# EAGLE design Sno_Shoe (EAGLE 9.6.2)
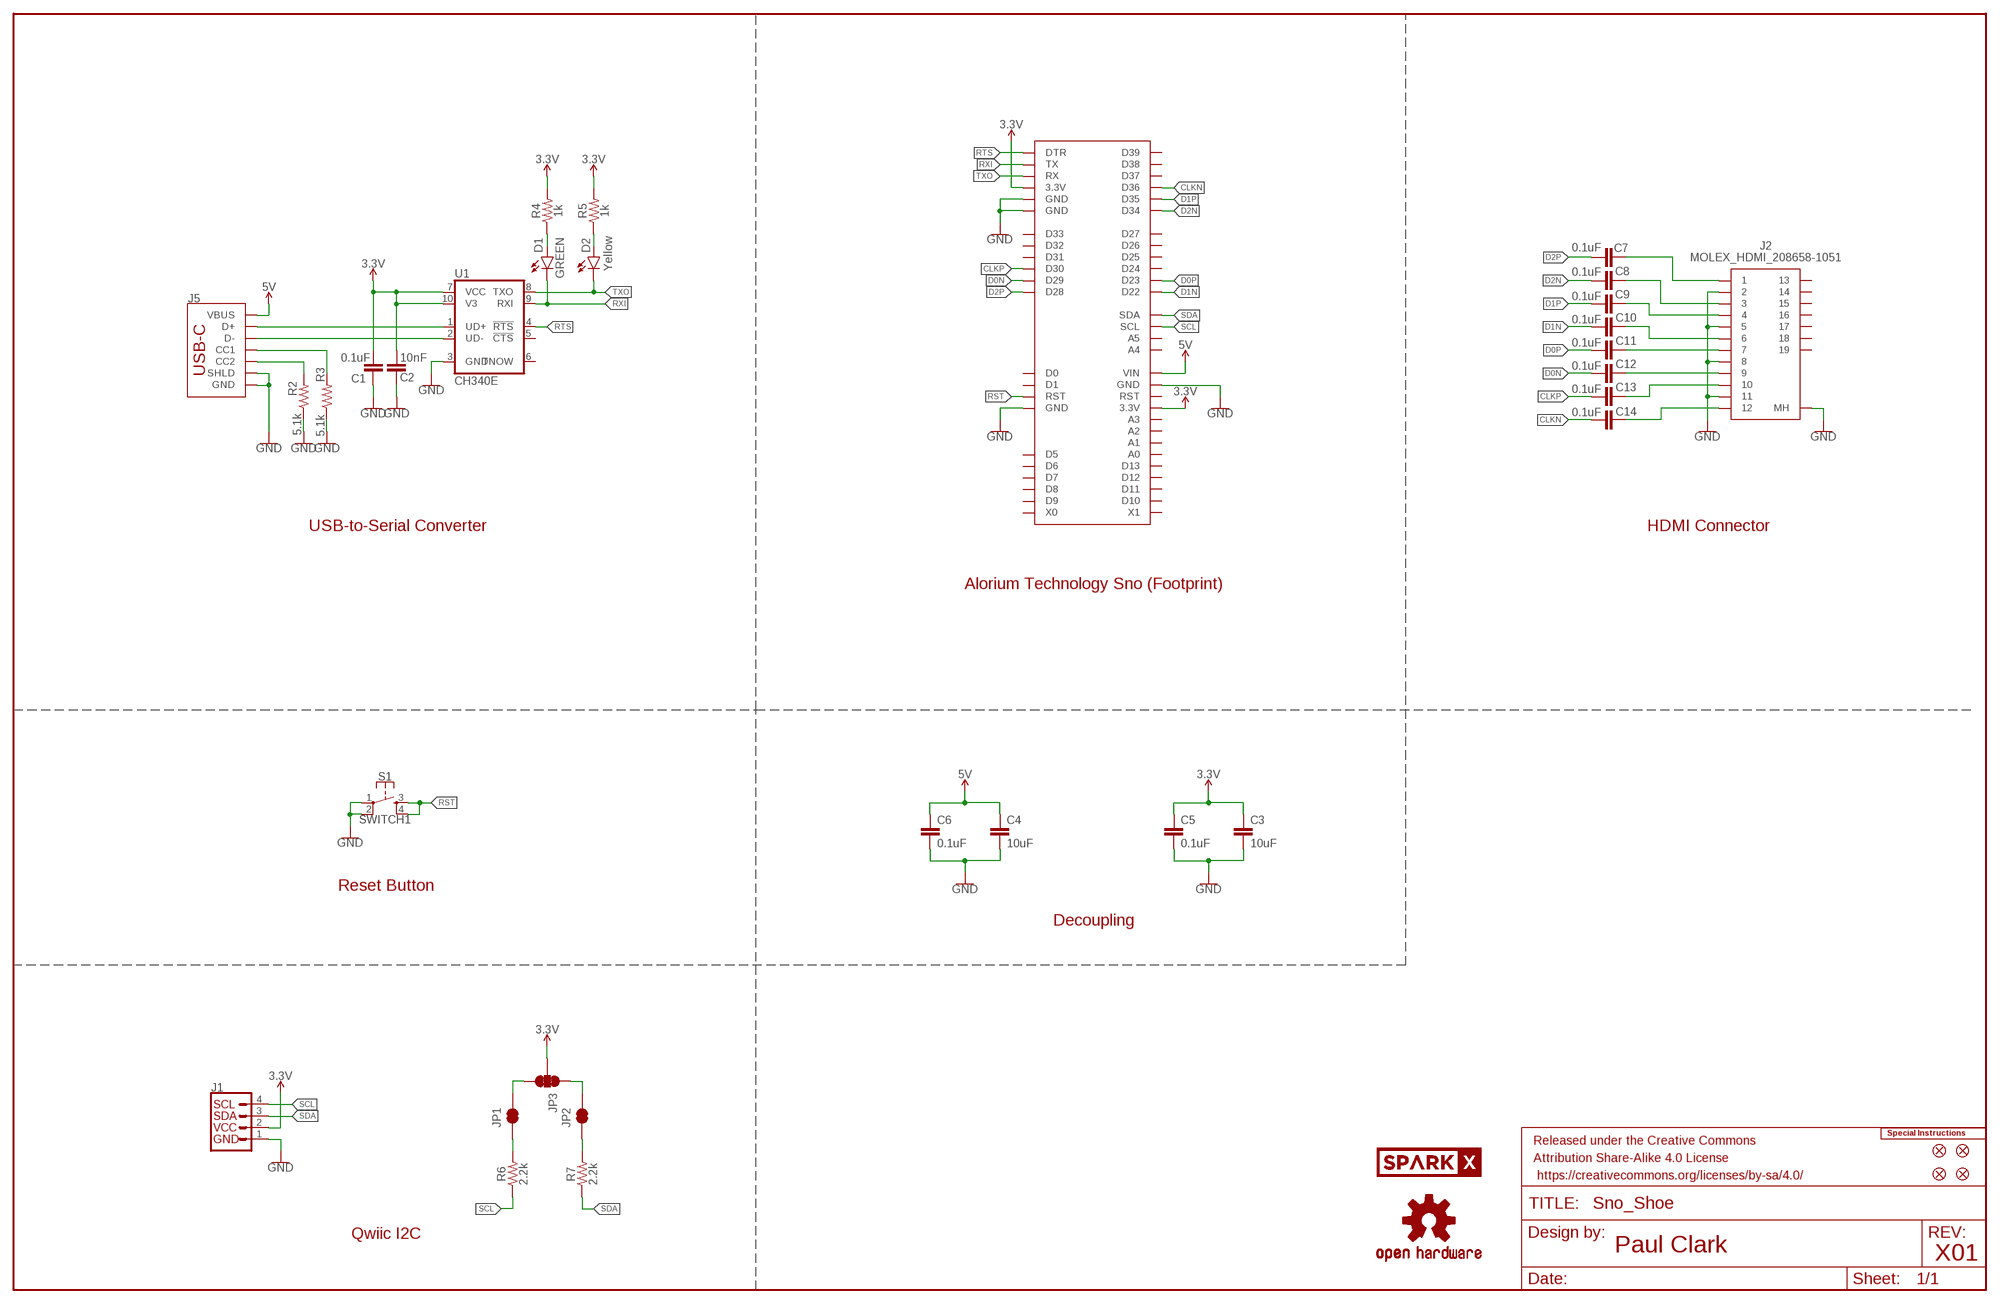
[diagram p0: schematic, sheet 1]

## Parts
C1  0.1uF  0.1UF-0402T-16V-10%  [0402-TIGHT]
C2  10nF  10NF-0402T-25V-10%  [0402-TIGHT]
C3  10uF  10UF-0402T-6.3V-20%  [0402-TIGHT]
C4  10uF  10UF-0805-10V-10%  [0805]
C5  0.1uF  0.1UF-0402T-10V-10%-X7R  [0402-TIGHT]
C6  0.1uF  0.1UF-0402T-10V-10%-X7R  [0402-TIGHT]
C7  0.1uF  0.1UF-0402T-10V-10%-X7R  [0402-TIGHT]
C8  0.1uF  0.1UF-0402T-10V-10%-X7R  [0402-TIGHT]
C9  0.1uF  0.1UF-0402T-10V-10%-X7R  [0402-TIGHT]
C10  0.1uF  0.1UF-0402T-10V-10%-X7R  [0402-TIGHT]
C11  0.1uF  0.1UF-0402T-10V-10%-X7R  [0402-TIGHT]
C12  0.1uF  0.1UF-0402T-10V-10%-X7R  [0402-TIGHT]
C13  0.1uF  0.1UF-0402T-10V-10%-X7R  [0402-TIGHT]
C14  0.1uF  0.1UF-0402T-10V-10%-X7R  [0402-TIGHT]
D1  GREEN  LED-GREEN0603  [LED-0603]
D2  Yellow  LED-YELLOW0603  [LED-0603]
FD1  FIDUCIAL1X2  [FIDUCIAL-1X2]
FD2  FIDUCIAL1X2  [FIDUCIAL-1X2]
FD3  FIDUCIAL1X2  [FIDUCIAL-1X2]
FD4  FIDUCIAL1X2  [FIDUCIAL-1X2]
FRAME1  FRAME-LEDGER  [CREATIVE_COMMONS]
J1  QWIIC_RIGHT_ANGLE  QWIIC_CONNECTORJS-1MM  [JST04_1MM_RA]
J2  MOLEX_HDMI_208658-1051  [MOLEX_HDMI_208658-1051]
J5  USB_C_4-LAYER_PADS  [USB-C-16P_4LAYER-PADS]
JP1  JUMPER-SMT_2_NC_TRACE_SILK  [SMT-JUMPER_2_NC_TRACE_SILK]
JP2  JUMPER-SMT_2_NC_TRACE_SILK  [SMT-JUMPER_2_NC_TRACE_SILK]
JP3  JUMPER-SMT_3_2-NC_TRACE_SILK  [SMT-JUMPER_3_2-NC_TRACE_SILK]
LOGO1  SPECIAL_INSTRUCTIONS-ORDERING  [ORDERING_INSTRUCTIONS]
LOGO2  OSHW-LOGOMINI  [OSHW-LOGO-MINI]
R2  5.1k  5.1KOHM-0402T-1/16W-1%  [0402-TIGHT]
R3  5.1k  5.1KOHM-0402T-1/16W-1%  [0402-TIGHT]
R4  1k  1KOHM-0402T-1/16W-1%  [0402-TIGHT]
R5  1k  1KOHM-0402T-1/16W-1%  [0402-TIGHT]
R6  2.2k  2.2KOHM-0402T-1/16W-1%  [0402-TIGHT]
R7  2.2k  2.2KOHM-0402T-1/16W-1%  [0402-TIGHT]
S1  SWITCH1  MOMENTARY-SWITCH-SPST-2-SMD-5.2MM-TALL  [TACTILE_SWITCH_SMD_5.2MM]
SPARKX2  SPARKX-LOGO4  [SPARKX-MEDIUM]
U1  CH340E  CH340E_MSOP10  [MSOP10]
U$1  SNO_MISSING_PINS  [SNO_MISSING_PINS]

## Nets
3.3V: C1.1 C2.1 C3.1 C5.1 J1.2 JP3.2 R4.2 R5.2 U1.7(VCC) U1.10(V3) U$1.P$28(3.3V) U$1.P$56(3.3V)
5V [Power]: C4.1 C6.1 J5.VBUS1(VBUS) J5.VBUS2(VBUS) U$1.P$31(VIN)
CC3: J5.B5(CC2) R2.2
CC4: J5.A5(CC1) R3.2
CLKN: C14.1 U$1.P$50(D36)
CLKP: C13.1 U$1.P$44(D30)
D0N: C12.1 U$1.P$43(D29)
D0P: C11.1 U$1.P$37(D23)
D1N: C10.1 U$1.P$36(D22)
D1P: C9.1 U$1.P$49(D35)
D2N: C8.1 U$1.P$48(D34)
D2P: C7.1 U$1.P$42(D28)
D+2: J5.A6(D+) J5.B6(D+) U1.1(UD+)
D-2: J5.A7(D-) J5.B7(D-) U1.2(UD-)
GND: C1.2 C2.2 C3.2 C4.2 C5.2 C6.2 J1.1 J2.2 J2.5 J2.8 J2.11 J2.MH1(MH) J2.MH2(MH) J2.MH3(MH) J2.MH4(MH) J5.GND J5.GND2(GND) J5.SHLD1(SHLD) J5.SHLD2(SHLD) J5.SHLD3(SHLD) J5.SHLD4(SHLD) R2.1 R3.1 S1.1 S1.2 U1.3(GND) U$1.P$4(GND) U$1.P$30(GND) U$1.P$54(GND) U$1.P$55(GND)
N$2: JP2.2 JP3.1
N$3: JP1.2 JP3.3
N$4: JP1.1 R6.2
N$5: JP2.1 R7.2
N$6: C7.2 J2.1
N$7: C8.2 J2.3
N$8: C9.2 J2.4
N$9: C10.2 J2.6
N$10: C11.2 J2.7
N$11: C12.2 J2.9
N$12: C13.2 J2.10
N$13: C14.2 J2.12
N$26: D1.A R4.1
N$27: D2.A R5.1
RST: S1.3 S1.4 U$1.P$3(RST)
RTS: U1.4(!RTS) U$1.P$59(DTR)
RXI: D1.C U1.9(RXI) U$1.P$58(TX)
SCL: J1.4 R6.1 U$1.P$34(SCL)
SDA: J1.3 R7.1 U$1.P$35(SDA)
TXO: D2.C U1.8(TXO) U$1.P$57(RX)
Unconnected: J2.13 J2.14 J2.15 J2.16 J2.17 J2.18 J2.19 U1.5(!CTS) U1.6(TNOW) U$1.P$1(D0) U$1.P$2(D1) U$1.P$8(D5) U$1.P$9(D6) U$1.P$10(D7) U$1.P$11(D8) U$1.P$12(D9) U$1.P$13(X0) U$1.P$19(X1) U$1.P$20(D10) U$1.P$21(D11) U$1.P$22(D12) U$1.P$23(D13) U$1.P$24(A0) U$1.P$25(A1) U$1.P$26(A2) U$1.P$27(A3) U$1.P$29(RST) U$1.P$32(A4) U$1.P$33(A5) U$1.P$38(D24) U$1.P$39(D25) U$1.P$40(D26) U$1.P$41(D27) U$1.P$45(D31) U$1.P$46(D32) U$1.P$47(D33) U$1.P$51(D37) U$1.P$52(D38) U$1.P$53(D39)

## Notes on the sheet
- USB-to-Serial Converter | HDMI Connector
- Alorium Technology Sno (Footprint)
- Reset Button
- Decoupling
- Qwiic I2C
- Paul Clark
- X01

## Library data of the parts
C1 = SparkFun-Capacitors:0.1UF: 0.1µF ceramic capacitors A capacitor is a passive two-terminal electrical component used to store electrical energy temporarily in an electric field.; PROD_ID: CAP-12416
C2 = SparkFun-Capacitors:10NF: 0.01uF/10nF/10,000pF ceramic capacitors A capacitor is a passive two-terminal electrical component used to store electrical energy temporarily in an electric field. CAP-09321; PROD_ID: CAP-14847
C3 = SparkFun-Capacitors:10UF: 10.0µF ceramic capacitors A capacitor is a passive two-terminal electrical component used to store electrical energy temporarily in an electric field.; PROD_ID: CAP-14848
C4 = SparkFun-Capacitors:10UF: 10.0µF ceramic capacitors A capacitor is a passive two-terminal electrical component used to store electrical energy temporarily in an electric field.; PROD_ID: CAP-11330
C5-C14 = SparkFun-Capacitors:0.1UF: 0.1µF ceramic capacitors A capacitor is a passive two-terminal electrical component used to store electrical energy temporarily in an electric field.; PROD_ID: CAP-15083
D1 = SparkFun-LED:LED-GREEN: Green SMD LED Used in manufacturing of various products at SparkFun Packages: 0603 - SMD 0603 package [Product Link] <http://www.futureelectronics.com/en/technologies/semiconductors/optoelectronics/leds/Pages/9894312-LTST-C190GKT.aspx?CrossPart=HSMG-C190&IM=0> LilyPad 1206 - SMD1206 LilyPad package [Product Link] <http://www.futureelectronics.com/en/Technologies/Product.aspx?ProductID=IN150NGHARVATEKCORPORATION2049943&IM=0> 1206 - SMD1206 package [Product Link] <http://www.futureelectronics.com/en/technologies/semiconductors/optoelectronics/leds/Pages/8315665-LTST-C150KGKT.aspx?IM=0> 1206 Bottom Mount -SMD 1206 Bottom Mount [Product Link] <http://www.digikey.com/product-detail/en/lite-on-inc/LTST-C230KGKT/160-1456-1-ND/386854> SparkFun Products: Pro Mini 328 -5V <https://www.sparkfun.com/products/821> RedBoard <https://www.sparkfun.com/products/12757> MP3 Trigger <https://www.sparkfun.com/products/13720> Makey Makey <https://www.sparkfun.com/products/11076>; PROD_ID: DIO-00821
D2 = SparkFun-LED:LED-YELLOW: Yellow SMD LED Used in manufacturing several products at SparkFun. Packages: 0603 - SMD 0603 package[Product Link] <http://www.kingbrightusa.com/product.asp?catalog_name=LED&product_id=APT1608SYCK> 0603 -SMART - SMART SMD 0603 package (more efficient/more expensive) [Product Link] <http://www.osram-os.com/osram_os/en/products/product-catalog/led-light-emitting-diodes/smartled-0603/ly-l29k/index.jsp> LilyPad - SMD1206 package[Product Datasheet] <https://www.sparkfun.com/datasheets/DevTools/LilyPad/Q150YUS4.pdf> SparkFun Products: Blynk Board <https://www.sparkfun.com/products/13794> IOIO-OTG <https://www.sparkfun.com/products/13613> XBee Explorer Serial <https://www.sparkfun.com/products/13225>; PROD_ID: DIO-09003
FD1-FD4 = SparkFun-Aesthetics:FIDUCIAL: Fiducial Alignment Points Point-of-reference for pick-and-place machines and other optical instruments.
FRAME1 = SparkFun-Aesthetics:FRAME-LEDGER: Schematic Frame - Ledger Standard 11x14 US Ledger frame
J1 = SparkFun-Connectors:QWIIC_CONNECTOR: SparkFun I2C Standard Qwiic Connector An SMD 1mm pitch JST connector makes it easy and quick (get it? Qwiic?) to connect I2C devices to each other. The Qwiic system <http://www.sparkfun.com/qwiic> enables fast and solderless connection between popular platforms and various sensors and actuators. We carry 200mm <https://www.sparkfun.com/products/14204>, 100mm <https://www.sparkfun.com/products/14205>, 50mm <https://www.sparkfun.com/products/14206>, and breadboard friendly <https://www.sparkfun.com/products/14207> Qwiic cables. We also offer 10 pcs strips <https://www.sparkfun.com/products/14323> the SMD connectors.; PROD_ID: CONN-13694
J2 = New_Parts:MOLEX_HDMI_208658-1051: 1.0 HDMI R/A HEADER ASSY (I/M TYPE) Source: Datasheet; DESCRIPTION: 1.0 HDMI R/A HEADER ASSY (I/M TYPE); MANUFACTURER_NAME: Molex; MANUFACTURER_PART_NUMBER: 208658-1051; MOUSER_PART_NUMBER: 538-208658-1051; MOUSER_PRICE-STOCK: https://www.mouser.co.uk/ProductDetail/Molex/208658-1051?qs=BJlw7L4Cy7%252Bu27sIkZU3Xw%3D%3D
J5 = SparkFun-Connectors:USB_C: USB Type C 16Pin Connector Super Speed pins not available on the 16-pin purely SMD connector so this part is best for USB 2.0 implementations. D1 and D2 are tied together enabling D+/- no matter which way the cable is plugged into the connector. The two channel configuration pins (CC1/2) are exposed. These are normally connected to ground via 5.1k resistors but can be reconfigured for high current/high power applications.; PROD_ID: CONN-14122
JP1 JP2 = SparkFun-Jumpers:JUMPER-SMT_2_NC_TRACE: Normally closed trace jumper This jumper has a trace between two pads so it's normally closed (NC). Use a razor knife to open the connection. For best results follow the IPC guidelines for cutting traces: Cutout at least 0.063 mm (0.005 in). Remove all loose material to clean up the cut area. Seal the cut with an approved epoxy. Reapply solder to reclose the connection.
JP3 = SparkFun-Jumpers:JUMPER-SMT_3_2-NC_TRACE: Normally closed trace jumper (2 of 2 connections) This jumper has a trace between all three pads so they are normally closed (NC). Use a razor knife to open the connection(s). For best results follow the IPC guidelines for cutting traces: Cutout at least 0.063 mm (0.005 in). Remove all loose material to clean up the cut area. Seal the cut with an approved epoxy. Reapply solder to reclose the connection(s).
LOGO1 = SparkFun-Aesthetics:SPECIAL_INSTRUCTIONS: Special Ordering/Production Instructions Alert Symbol for special PCB ordering instructions or unique production process warnings. Ordering Instructions Production Instructions Types of information that should be added to box: Copper weight Soldermask color Silk color PCB thickness Number of layers PCB Standard: 1.6mm FR4 1 oz copper immersion silver plating red soldermask white silkscreen Types of information that should be added to box: Special wash requirements Depaneling instructions Humidification Glue curing Default text settings: 0.07 inch 9% ratio 50% line distance
LOGO2 = SparkFun-Aesthetics:OSHW-LOGO: Open-Source Hardware (OSHW) Logo This logo indicates the piece of hardware it is found on incorporates a OSHW license and/or adheres to the definition of open source hardware found here: http://freedomdefined.org/OSHW
R2 R3 = SparkFun-Resistors:5.1KOHM; PROD_ID: RES-14340
R4 R5 = SparkFun-Resistors:1KOHM: 1kΩ resistor A resistor is a passive two-terminal electrical component that implements electrical resistance as a circuit element. Resistors act to reduce current flow, and, at the same time, act to lower voltage levels within circuits. - Wikipedia; PROD_ID: RES-14342
R6 R7 = SparkFun-Resistors:2.2KOHM: 2.2kΩ resistor A resistor is a passive two-terminal electrical component that implements electrical resistance as a circuit element. Resistors act to reduce current flow, and, at the same time, act to lower voltage levels within circuits. - Wikipedia; PROD_ID: RES-14341
S1 = SparkFun-Switches:MOMENTARY-SWITCH-SPST-2: Momentary Switch (Pushbutton) - SPST - Two Circuits Normally-open (NO) SPST momentary switches (buttons, pushbuttons). Schematic symbol includes two switch circuits. Variants SMD-4.6MMX2.8MM - 4.60mm x 2.80mm Tactile Momentary Button Switch - Used on SparkFun SAMD21 Mini Breakout <https://www.sparkfun.com/products/13664> SMD-5.2MM - Mini Pushbutton Switch - SMD <https://www.sparkfun.com/products/8720> - Used on Arduino Pro Mini <https://www.sparkfun.com/products/11114>; PROD_ID: SWCH-14139
SPARKX2 = SparkX:SPARKX-LOGO
U1 = SparkFun-IC-Comms:CH340E; PROD_ID: IC-14135
U$1 = New_Parts:SNO_MISSING_PINS: Alorium Technology - Snō Source: Mechanical Drawing <https://www.aloriumtech.com/documents/Sno_Mechanical_Drawing.pdf> Pin Map <https://www.aloriumtech.com/documents/Sno_Pin_Map.pdf> Schematic <https://www.aloriumtech.com/documents/Sno_Schematic.pdf>

## Net classes
1 Power: width 0.406 mm

## Board
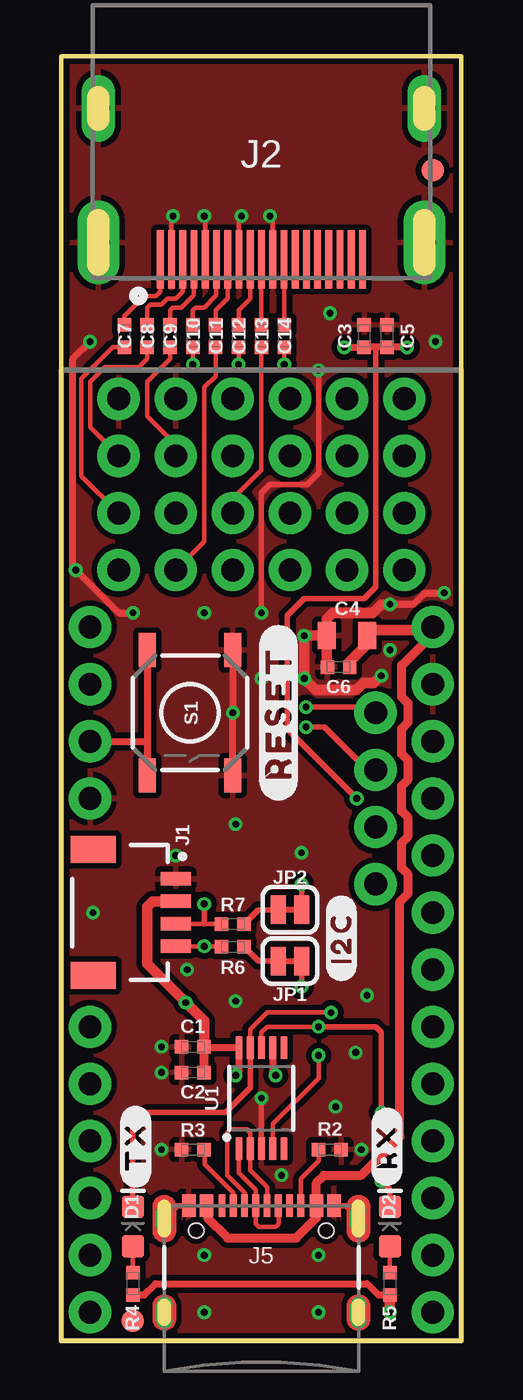
[diagram p1: board, top side]
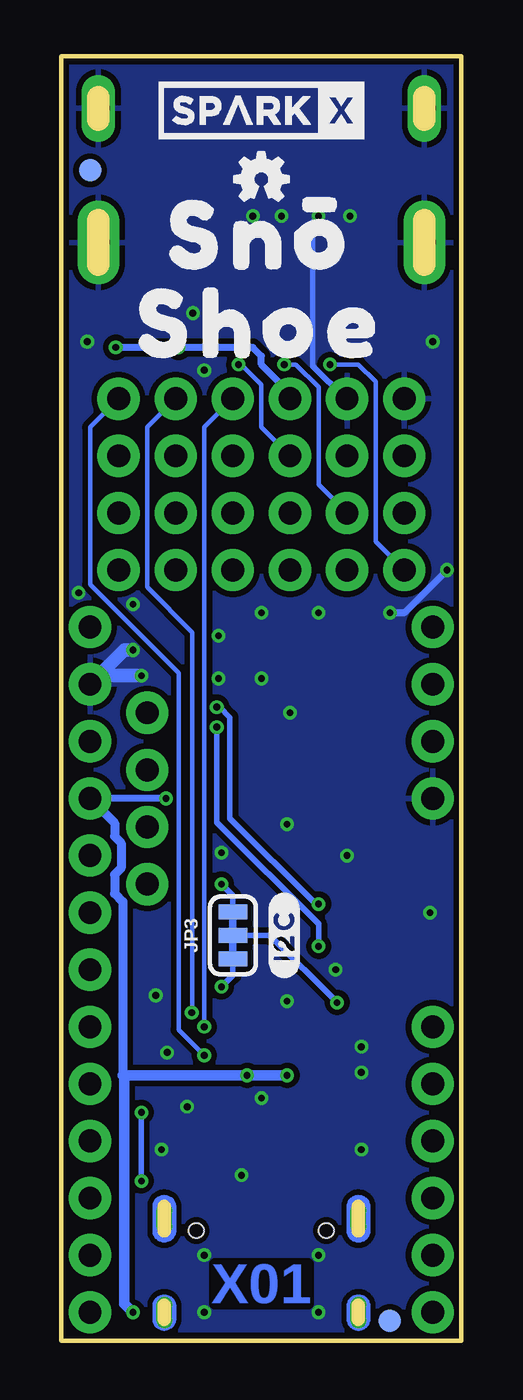
[diagram p2: board, bottom side, seen from below]

Size 17.78 x 57.15 mm. Coordinates in mm from the lower left corner, seen from the top.
Outline: 0,0 17.78,0 17.78,57.15 0,57.15 0,0
Copper layers (1*16): Top 0.035mm / dielectric 1.5mm / Bottom 0.035mm
Design rules "SparkFun-2-layer-PCBWay-LIMIT": minimum track width 6mil, minimum drill 0.3mm, track to track 6mil, track to pad 6mil, pad to pad 6mil, via to via 6mil, smd to smd 6mil, copper to edge 6mil, drill to drill 6mil, minimum pad ring 6mil, minimum via ring 6mil, stop-mask expansion 4mil, vias tented up to drill 25mil, thermal gap 10mil

### Footprints (pad centres in the part's own frame; a part is rotated, then mirrored left to right if it is on the bottom)
0402-TIGHT = smd 0.6 x 0.6: 1 -0.5,0; 2 0.5,0
0805 = smd 0.8 x 1.2: 1 -0.9,0; 2 0.9,0
LED-0603 = smd 1 x 1: A -0.877,0; C 0.877,0
FIDUCIAL-1X2 = smd 1 x 1: 1 0,0
JST04_1MM_RA = smd 0.6 x 1.35: 1 -1.5,0; 2 -0.5,0; 3 0.5,0; 4 1.5,0 | smd 1.2 x 2: NC1 2.8,-3.675; NC2 -2.8,-3.675
MOLEX_HDMI_208658-1051 = smd 0.3 x 2.6: 1 4.5,5.235; 2 4,5.235; 3 3.5,5.235; 4 3,5.235; 5 2.5,5.235; 6 2,5.235; 7 1.5,5.235; 8 1,5.235; 9 0.5,5.235; 10 0,5.235; 11 -0.5,5.235; 12 -1,5.235; 13 -1.5,5.235; 14 -2,5.235; 15 -2.5,5.235; 16 -3,5.235; 17 -3.5,5.235; 18 -4,5.235; 19 -4.5,5.235 | drill 1 pad 1.875 long: MH1 -7.25,4.475; MH2 7.25,4.475 | drill 1 long: MH3 -7.25,-1.485; MH4 7.25,-1.485
USB-C-16P_4LAYER-PADS = smd 0.3 x 1: A5 -1.25,-0.34; A6 -0.25,-0.34; A7 0.25,-0.34; A8 1.25,-0.34; B5 1.75,-0.34; B6 0.75,-0.34; B7 -0.75,-0.34; B8 -1.75,-0.34 | smd 0.6 x 1: GND -3.225,-0.34; GND2 3.225,-0.34; VBUS1 -2.45,-0.34; VBUS2 2.45,-0.34 | drill 0.4 pad 0.6 long: SHLD1 -4.318,-0.915; SHLD2 4.318,-0.915; SHLD3 -4.318,-5.095; SHLD4 4.318,-5.095 | hole 0.65: -2.89,-1.445; 2.89,-1.445
SMT-JUMPER_2_NC_TRACE_SILK = smd 0.66 x 1.27: 1 -0.521,0; 2 0.521,0
SMT-JUMPER_3_2-NC_TRACE_SILK = smd 0.66 x 1.27: 1 -1.041,0; 2 0,0; 3 1.041,0
TACTILE_SWITCH_SMD_5.2MM = smd 1.524 x 0.762: 1 -2.794,1.905; 2 2.794,1.905; 3 -2.794,-1.905; 4 2.794,-1.905
MSOP10 = smd 1 x 0.3: 1 -2.25,1; 2 -2.25,0.5; 3 -2.25,0; 4 -2.25,-0.5; 5 -2.25,-1; 6 2.25,-1; 7 2.25,-0.5; 8 2.25,0; 9 2.25,0.5; 10 2.25,1
SNO_MISSING_PINS = drill 1.016 pad 1.88: P$1 10.16,7.62; P$2 7.62,7.62; P$3 5.08,7.62; P$4 2.54,7.62; P$8 -7.62,7.62; P$9 -10.16,7.62; P$10 -12.7,7.62; P$11 -15.24,7.62; P$12 -17.78,7.62; P$13 -20.32,7.62; P$19 -20.32,-7.62; P$20 -17.78,-7.62; P$21 -15.24,-7.62; P$22 -12.7,-7.62; P$23 -10.16,-7.62; P$24 -7.62,-7.62; P$25 -5.08,-7.62; P$26 -2.54,-7.62; P$27 0,-7.62; P$28 2.54,-7.62; P$29 5.08,-7.62; P$30 7.62,-7.62; P$31 10.16,-7.62; P$32 -1.27,-5.08; P$33 1.27,-5.08; P$34 3.81,-5.08; P$35 6.35,-5.08; P$36 12.7,6.35; P$37 12.7,3.81; P$38 12.7,1.27; P$39 12.7,-1.27; P$40 12.7,-3.81; P$41 12.7,-6.35; P$42 15.24,6.35; P$43 15.24,3.81; P$44 15.24,1.27; P$45 15.24,-1.27; P$46 15.24,-3.81; P$47 15.24,-6.35; P$48 17.78,6.35; P$49 17.78,3.81; P$50 17.78,1.27; P$51 17.78,-1.27; P$52 17.78,-3.81; P$53 17.78,-6.35; P$54 20.32,6.35; P$55 20.32,3.81; P$56 20.32,1.27; P$57 20.32,-1.27; P$58 20.32,-3.81; P$59 20.32,-6.35

### Placement (x,y rotation side)
C1  5.84,13.08 180 top
C2  5.84,11.94 180 top
C3  13.46,44.7 90 top
C4  12.7,31.37 180 top
C5  14.48,44.7 90 top
C6  12.32,29.97 180 top
C7  2.79,44.7 90 top
C8  3.81,44.7 90 top
C9  4.83,44.7 90 top
C10  5.84,44.7 90 top
C11  6.86,44.7 90 top
C12  7.87,44.7 90 top
C13  8.89,44.7 90 top
C14  9.91,44.7 90 top
D1  3.17,5.08 90 top
D2  14.61,5.08 90 top
FD1  16.51,52.07 0 top
FD2  3.17,0.89 0 top
FD3  16.51,52.07 0 bottom
FD4  3.17,0.89 0 bottom
FRAME1  48.26,54.61 0 top  (outside the outline)
J1  5.08,19.05 270 top
J2  8.89,53.34 180 top
J5  8.89,6.35 0 top
JP1  10.16,16.89 0 top
JP2  10.16,19.18 0 top
JP3  10.16,18.03 270 bottom
LOGO1  22.86,50.8 0 top  (outside the outline)
LOGO2  8.89,51.69 0 bottom
R2  11.94,8.51 180 top
R3  5.84,8.51 0 top
R4  3.17,2.54 270 top
R5  14.61,2.54 270 top
R6  7.62,17.53 0 top
R7  7.62,18.54 0 top
S1  5.71,27.94 270 top
SPARKX2  8.89,54.74 0 bottom
U1  8.89,10.79 90 top
U$1  8.89,21.59 90 top
U$2  [SNO0]  8.89,49.15 0 bottom
U$3  [SHOE0]  8.89,45.21 0 bottom
U$4  [#0]  6.1,50.55 0 bottom
U$5  [#RESET#0]  9.65,27.94 90 top
U$6  [#I2C#0]  12.45,17.91 90 top
U$7  [#I2C#0]  7.87,18.03 90 bottom
U$8  [#TX#0]  3.3,8.64 90 top
U$9  [#RX#0]  14.48,8.64 90 top

### Tracks (layer width: path | path; a pad name or v marks a point on that pad's centre or on a via)
3.3V  (via drill 0.3)
  Top 0.254: 13.97,44.2 13.97,33.53 13.46,33.02 10.79,33.02 10.03,32.26 10.03,27.23 v13.13,24.13
  Top 0.305: C1.1 6.38,13.04 U1.10 7.89,11.95 v7.75,11.81 | R4.2 3.69,2.04 4.19,2.54 13.59,2.54 14.09,2.04 R5.2 | U1.7 9.39,11.95 v9.53,11.81 | v15.37,44.2 v15.36,44.2 C5.1 13.97,44.2 C3.1 v12.57,44.2
  Top 0.406: C2.1 C1.1
  Top 0.457: v14.61,1.27 R5.2 | J1.2 4.06,19.55 3.81,19.3 3.81,16.76 v5.52,15.05 6.35,14.22 C1.1
  Bottom 0.254: JP3.2 8.51,18.03 v5.52,15.05
  Bottom 0.305: v15.37,44.2 v12.57,44.2 9.27,44.2 8.89,43.81 8.89,43.43 7.62,42.16 U$1.P$56 | v13.13,24.13 U$1.P$28
  Bottom 0.406: U$1.P$28 15.42,23.04 15.42,22.44 15.13,22.15 15.13,21.03 15.42,20.74 15.42,19.9 15.05,19.53 15.05,11.81
  Bottom 0.457: v14.61,1.27 14.99,1.65 14.99,11.81 | v7.75,11.81 v9.53,11.81 14.99,11.81 | 14.99,11.81 15.05,11.81
5V
  Top 0.406: 6.48,5.97 6.48,5.48 7.39,4.57 10.45,4.57 11.34,5.46 J5.VBUS2 11.34,7.02 11.68,7.37 13.34,7.37 15.05,9.08 15.05,19.53 15.42,19.9 15.42,20.74 15.13,21.03 15.13,22.15 15.42,22.44 15.42,23.28 15.13,23.57 15.13,24.69 15.42,24.98 15.42,25.82 15.13,26.11 15.13,27.23 15.42,27.52 15.42,28.36 15.13,28.65 15.13,30.05 16.51,31.43
  Top 0.457: J5.VBUS1 6.48,5.97 | 16.51,31.43 U$1.P$31 16.38,31.62 13.85,31.62 C4.1 13.6,31.01 12.82,30.23 C6.1
CC3
  Top 0.203: R2.2 11.44,8 10.64,7.2 J5.B5
CC4
  Top 0.203: R3.2 6.38,8.48 6.38,7.85 7.64,6.59 J5.A5
CLKN  (via drill 0.3)
  Top 0.203: C14.1 v9.91,43.43
  Bottom 0.203: v9.91,43.43 9.78,43.43 8.89,42.55 8.89,40.64 U$1.P$50
CLKP
  Top 0.203: U$1.P$44 7.62,37.47 8.89,38.73 C13.1
D0N  (via drill 0.3)
  Top 0.203: C12.1 v7.87,43.43
  Bottom 0.203: U$1.P$43 6.35,38.1 6.35,42.42 7.37,43.43 v7.87,43.43
D0P
  Top 0.203: C11.1 6.86,42.93 6.35,42.42 6.35,35.56 U$1.P$37
D1N  (via drill 0.3)
  Top 0.203: C10.1 v5.84,43.43
  Bottom 0.203: U$1.P$36 3.81,35.56 3.81,42.67 4.57,43.43 v5.84,43.43
D1P
  Top 0.203: C9.1 4.83,43.69 3.81,42.67 3.81,41.15 5.08,39.88 U$1.P$49
D2N
  Top 0.203: C8.1 3.81,43.7 3.43,43.31 1.91,43.31 1.27,42.67 1.27,40.64 U$1.P$48
D2P
  Top 0.203: U$1.P$42 0.89,38.48 0.89,42.81 2.29,44.2 C7.1
D+2
  Top 0.203: U1.1 7.89,7.48 8.64,6.73 J5.A6 8.64,5.2 8.76,5.08 9.53,5.08 9.65,5.21 9.65,6 J5.B6
D-2
  Top 0.203: J5.A7 9.14,6.84 8.39,7.59 U1.2 8.39,9.26 8.26,9.4 7.49,9.4 7.37,9.27 7.37,7.37 8.14,6.59 J5.B7
GND  (via drill 0.3)
  Top 0.203: J2.2 4.89,49.98 v4.95,50.04 | J2.5 6.39,50 v6.35,50.04 | J2.8 7.89,49.93 v8,50.04 | J2.11 9.39,49.92 v9.27,50.04
  Top 0.254: U1.3 v8.89,10.79 | J5.GND2 12.63,6.01 J5.SHLD2 | J5.GND 5.15,6.01 J5.SHLD1 | v8.89,32.38 8.89,37.72 9.27,38.1 10.92,38.1 11.43,38.61 v11.43,43.18
  Top 0.305: S1.1 v7.62,27.94 S1.2 | v3.17,32.38 2.54,32.38 v0.64,34.29 0.48,34.44 0.48,43.66 v1.27,44.45 | v17.02,33.27 16.99,33.25 16.12,33.25 15.64,32.77 v14.61,32.77
  Top 0.457: C4.2 v10.79,31.37 v10.79,29.46 11.3,28.96 13.12,28.96 13.42,29.26 13.89,29.26 v14.22,29.59 | C6.2 11.8,29.99 C4.2 | v14.61,32.77 14.22,32.77 13.84,32.38 12.06,32.38 11.8,32.12 C4.2
  Bottom 0.254: v6.35,50.04 6.6,49.78 6.6,43.37 5.14,41.91 U$1.P$55
  Bottom 0.305: v0.64,34.29 2.54,32.38 v3.17,32.38
  Bottom 0.457: U$1.P$30 16.13,29.59
  Bottom 0.61: 16.13,29.59 v14.22,29.59 | U$1.P$30 14.99,30.73 v14.61,30.73
  other vias: 6.35,1.27 11.43,1.27 6.35,3.81 11.43,3.81 4.45,13.08 4.45,11.94 4.45,8.51 13.34,8.51 5.08,21.59 8.89,29.46 12.19,10.41 13.08,12.83 13.59,15.37 7.75,15.11 10.67,21.72 1.4,19.05 7.75,22.99 6.35,32.38 16.64,44.45 11.94,45.72 9.78,7.37 5.59,16.51
  pour Top (isolate 0.254): 0,0 17.78,0 17.78,57.15 0,57.15
  pour Bottom (isolate 0.254): 0,0 17.78,0 17.78,57.15 0,57.15
N$2  (via drill 0.3)
  Top 0.254: JP2.2 10.68,20.31 v10.67,20.32
  Bottom 0.254: v10.67,20.32 10.16,19.81 JP3.1
N$3  (via drill 0.3)
  Top 0.254: JP1.2 v10.68,15.76 v10.67,15.75
  Bottom 0.254: v10.67,15.75 10.16,16.26 JP3.3
N$4
  Top 0.254: R6.2 8.76,16.89 JP1.1
N$5
  Top 0.254: R7.2 8.76,19.18 JP2.1
N$6
  Top 0.203: J2.1 4.39,46.68 4.19,46.48 3.68,46.48 2.79,45.59 C7.2
N$7
  Top 0.203: J2.3 5.39,46.66 5.08,46.35 4.7,46.35 4.45,46.1 3.94,46.1 3.81,45.97 C8.2
N$8
  Top 0.203: J2.4 5.89,46.53 5.33,45.97 4.95,45.97 4.83,45.85 C9.2
N$9
  Top 0.203: J2.6 6.89,46.51 6.35,45.97 5.97,45.97 5.84,45.85 C10.2
N$10
  Top 0.203: J2.7 7.39,46.38 6.86,45.85 C11.2
N$11
  Top 0.203: J2.9 8.39,46.36 7.87,45.85 C12.2
N$12
  Top 0.203: J2.10 C13.2
N$13
  Top 0.203: J2.12 9.91,48.09 C14.2
N$26
  Top 0.203: R4.1 D1.A
N$27
  Top 0.203: R5.1 D2.A
RST
  Top 0.305: S1.3 3.81,26.67 | 3.81,26.67 S1.4 | U$1.P$3 3.81,26.67
RTS  (via drill 0.3)
  Top 0.203: U1.4 9.39,9.64 11.43,11.68 v11.43,12.7
  Bottom 0.203: U$1.P$59 16.51,40.64 16.51,33.66 12.57,29.72 12.57,13.84 v11.43,12.7
RXI  (via drill 0.3)
  Top 0.203: U1.9 8.39,13.85 9.14,14.61 v11.99,14.61
  Top 0.254: D1.C 3.17,9.53 3.81,10.16 7.3,10.16 8.39,11.24 U1.9
  Bottom 0.203: U$1.P$58 13.97,40.64 13.97,33.53 11.96,31.52 11.96,14.63 v11.99,14.61
SCL  (via drill 0.3)
  Top 0.203: J1.4 v6.35,17.55 7.1,17.55 R6.1
  Top 0.254: U$1.P$34 13.59,25.4 11.68,27.3 v10.87,27.3
  Bottom 0.254: v10.87,27.3 10.87,23.07 6.35,18.54 v6.35,17.55
SDA  (via drill 0.3)
  Top 0.203: J1.3 6.35,18.55 R7.1
  Top 0.254: U$1.P$35 13.72,28.19 v10.87,28.19 | v6.35,19.43 6.35,18.55
  Bottom 0.254: v10.87,28.19 10.75,28.19 10.29,27.73 10.29,23.24 6.48,19.43 v6.35,19.43
TXO  (via drill 0.3)
  Top 0.203: U1.8 8.89,13.72 9.14,13.97 v11.43,13.97
  Top 0.254: D2.C 14.61,6.73 v14.22,7.11 | v14.22,10.16 14.22,13.72 13.97,13.97 v11.43,13.97
  Bottom 0.203: U$1.P$57 11.43,40.64 v11.43,13.97
  Bottom 0.254: v14.22,7.11 v14.22,10.16

### Text on the board
Bottom: X01
tDocu: Paul Clark | 2-layer board | 1.6mm thickness | HASL finish